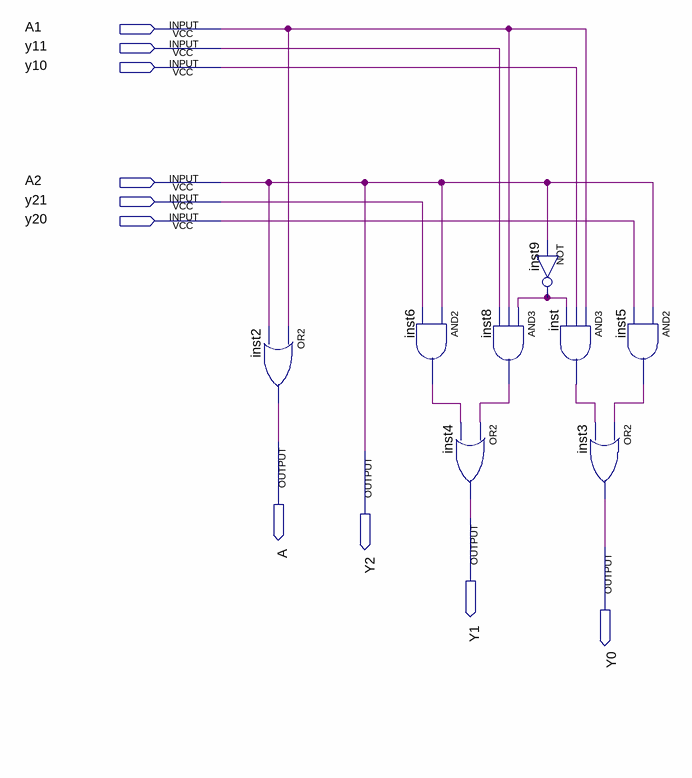
[diagram p0: schematic sheet]
// Quartus schematic H.bdf as structural Verilog: 8 symbols, 10 pins
module H (
  input  A1,
  input  y11,
  input  y10,
  input  A2,
  input  y21,
  input  y20,
  output A,
  output Y2,
  output Y1,
  output Y0
);

  wire inst5_out, inst6_out, inst8_out, inst9_out, inst_out;

  or inst2 (A, A1, A2);
  and inst6 (inst6_out, A2, y21);
  or inst4 (Y1, inst8_out, inst6_out);
  not inst9 (inst9_out, A2);
  and inst8 (inst8_out, inst9_out, A1, y11);
  and inst (inst_out, A1, y10, inst9_out);
  or inst3 (Y0, inst5_out, inst_out);
  and inst5 (inst5_out, A2, y20);

  assign Y2 = A2;
endmodule
